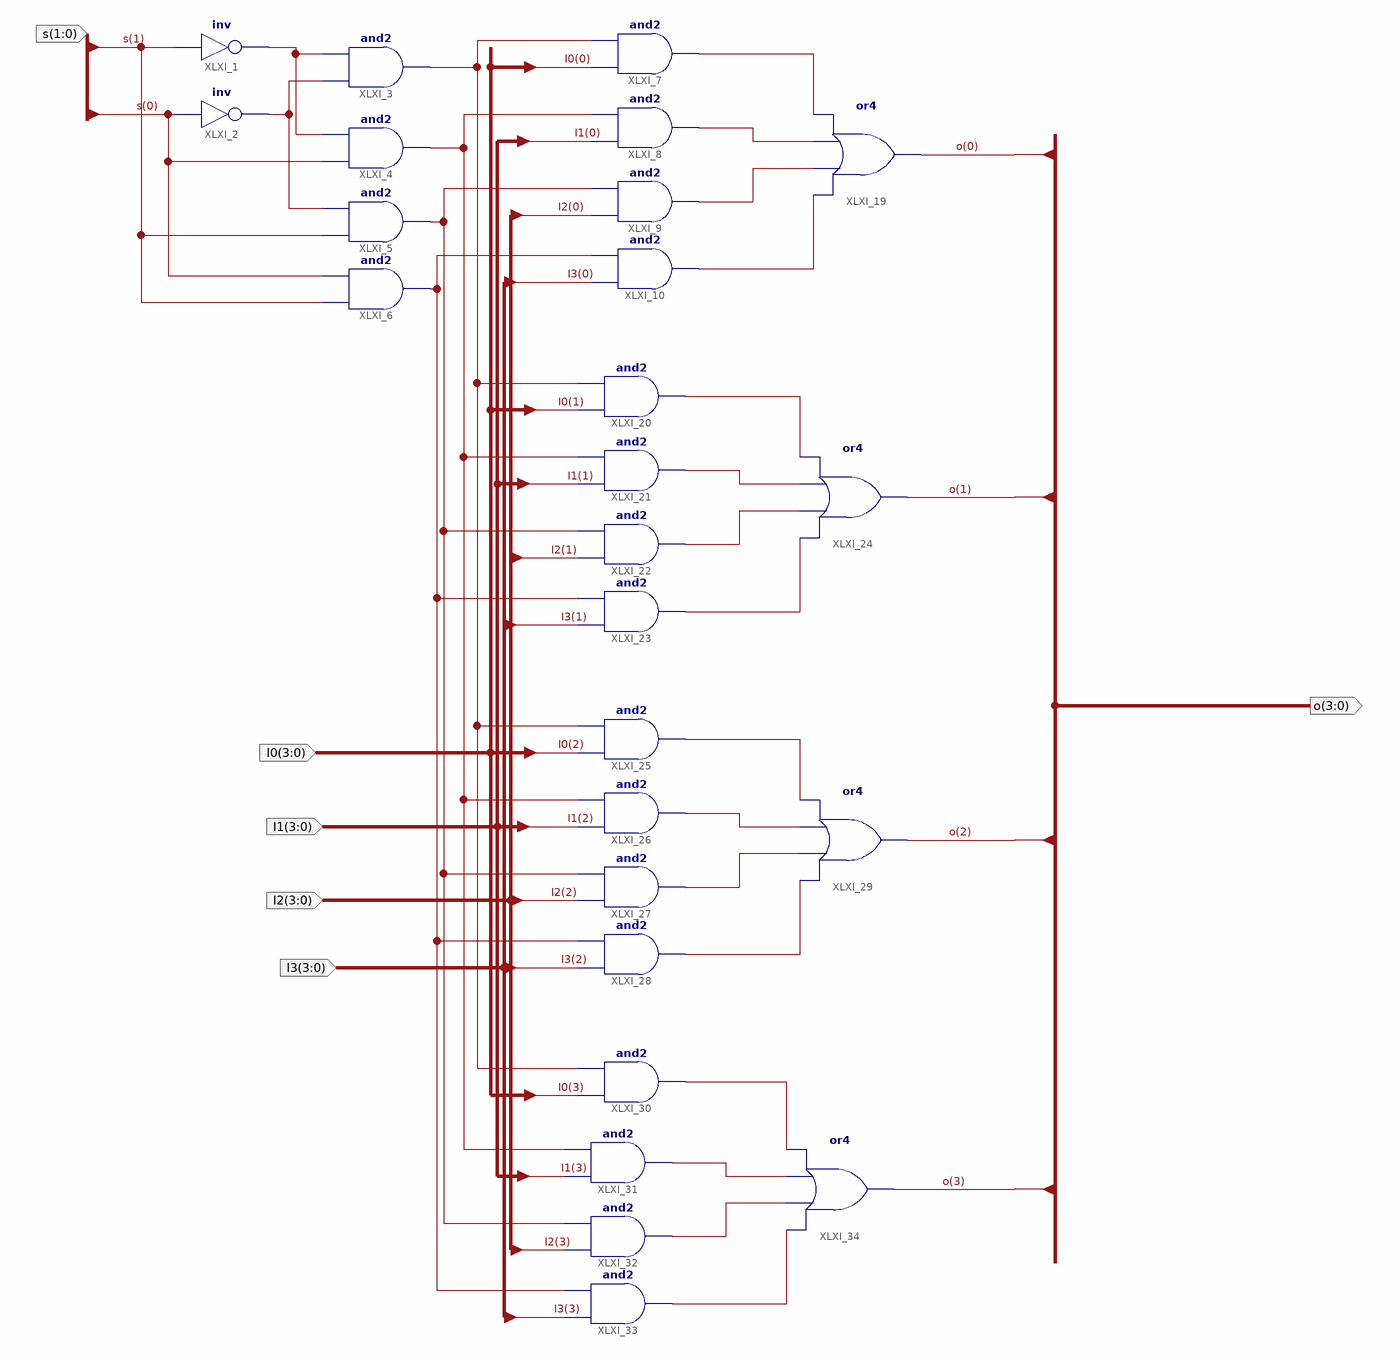
[diagram p0: schematic sheet 1]
// Xilinx ISE schematic MUX4T1.sch (kintex7) as structural Verilog: 26 symbols, 6 ports
module MUX4T1 (
  input  [1:0] s,
  input  [3:0] I0,
  input  [3:0] I1,
  input  [3:0] I2,
  input  [3:0] I3,
  output [3:0] o
);

  wire XLXN_1, XLXN_2, XLXN_3, XLXN_4, XLXN_5, XLXN_6, XLXN_7, XLXN_8, XLXN_9, XLXN_10, XLXN_11, XLXN_12,
       XLXN_13, XLXN_14, XLXN_15, XLXN_16, XLXN_17, XLXN_23, XLXN_29, XLXN_30, XLXN_31, XLXN_32;

  not XLXI_1 (XLXN_17, s[1]);
  not XLXI_2 (XLXN_23, s[0]);
  and XLXI_3 (XLXN_29, XLXN_23, XLXN_17);
  and XLXI_4 (XLXN_30, s[0], XLXN_17);
  and XLXI_5 (XLXN_31, s[1], XLXN_23);
  and XLXI_6 (XLXN_32, s[1], s[0]);
  and XLXI_7 (XLXN_1, I0[0], XLXN_29);
  and XLXI_8 (XLXN_2, I1[0], XLXN_30);
  and XLXI_9 (XLXN_3, I2[0], XLXN_31);
  and XLXI_10 (XLXN_4, I3[0], XLXN_32);
  or XLXI_19 (o[0], XLXN_4, XLXN_3, XLXN_2, XLXN_1);
  and XLXI_20 (XLXN_5, I0[1], XLXN_29);
  and XLXI_21 (XLXN_6, I1[1], XLXN_30);
  and XLXI_22 (XLXN_7, I2[1], XLXN_31);
  and XLXI_23 (XLXN_8, I3[1], XLXN_32);
  or XLXI_24 (o[1], XLXN_8, XLXN_7, XLXN_6, XLXN_5);
  and XLXI_25 (XLXN_9, I0[2], XLXN_29);
  and XLXI_26 (XLXN_10, I1[2], XLXN_30);
  and XLXI_27 (XLXN_11, I2[2], XLXN_31);
  and XLXI_28 (XLXN_12, I3[2], XLXN_32);
  or XLXI_29 (o[2], XLXN_12, XLXN_11, XLXN_10, XLXN_9);
  and XLXI_30 (XLXN_13, I0[3], XLXN_29);
  and XLXI_31 (XLXN_14, I1[3], XLXN_30);
  and XLXI_32 (XLXN_15, I2[3], XLXN_31);
  and XLXI_33 (XLXN_16, I3[3], XLXN_32);
  or XLXI_34 (o[3], XLXN_16, XLXN_15, XLXN_14, XLXN_13);
endmodule
